# Altium schematic sheet MaxModule.SchDoc
size A4; SheetNumber: 5; SheetTotal: 6
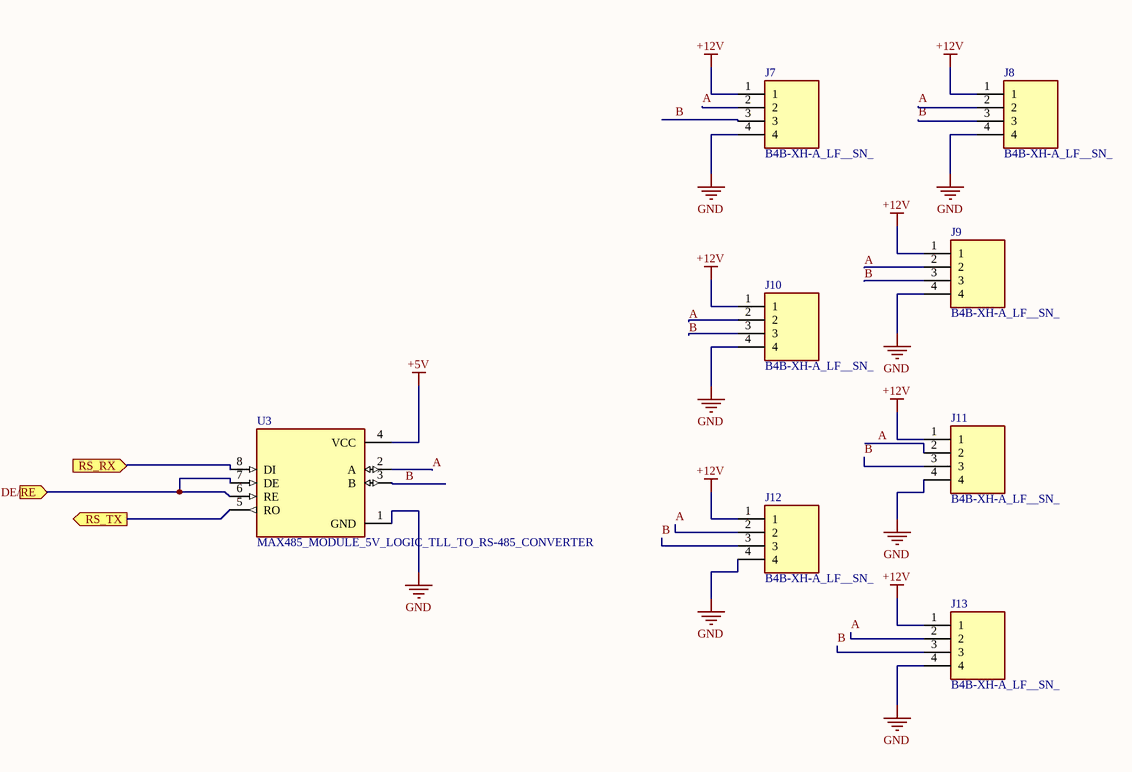
[diagram p0: MaxModule.SchDoc]

## Parts
J7  B4B-XH-A_LF__SN_  [B4BXHALFSN]
J8  B4B-XH-A_LF__SN_  [B4BXHALFSN]
J9  B4B-XH-A_LF__SN_  [B4BXHALFSN]
J10  B4B-XH-A_LF__SN_  [B4BXHALFSN]
J11  B4B-XH-A_LF__SN_  [B4BXHALFSN]
J12  B4B-XH-A_LF__SN_  [B4BXHALFSN]
J13  B4B-XH-A_LF__SN_  [B4BXHALFSN]
U3  MAX485_MODULE_5V_LOGIC_TLL_TO_RS-485_CONVERTER  [MODULE_MAX485_MODULE_5V_LOGIC_TLL_TO_RS-485_CONVERTER]

## Ports
DE/RE (in), RS_RX (in), RS_TX (out)

## Nets
+5V: U3.4(VCC)
+12V: J7.1 J8.1 J9.1 J10.1 J11.1 J12.1 J13.1
GND: J7.4 J8.4 J9.4 J10.4 J11.4 J12.4 J13.4 U3.1(GND)
A: J7.2 J8.2 J9.2 J10.2 J11.2 J12.2 J13.2 U3.2(A)
B: J7.3 J8.3 J9.3 J10.3 J11.3 J12.3 J13.3 U3.3(B)
DE/RE: U3.6(RE) U3.7(DE) ; port DE/RE
RS_RX: U3.8(DI) ; port RS_RX
RS_TX: U3.5(RO) ; port RS_TX

## Library data of the parts
J7-J13 = B4B-XH-A_LF__SN_: Connector; Manufacturer_Name: JST (JAPAN SOLDERLESS TERMINALS); Manufacturer_Part_Number: B4B-XH-A(LF)(SN); Datasheet Link: https://datasheet.lcsc.com/szlcsc/JST-Sales-America-B4B-XH-A-LF-SN_C144395.pdf; Height: 7mm; Mouser Part Number: 306-B4BXHALFSN; Mouser Price/Stock: https://www.mouser.co.uk/ProductDetail/JST-Commercial/B4B-XH-ALFSN?qs=cdbOS8ANM9CfC08d%252BywhFw%3D%3D; Arrow Part Number: B4B-XH-A(LF)(SN); Arrow Price/Stock: https://www.arrow.com/en/products/b4b-xh-a-lf-sn/jst-manufacturing?utm_currency=USD&region=europe
U3 = MAX485_MODULE_5V_LOGIC_TLL_TO_RS-485_CONVERTER: 5V MAX485 TTL To RS485 Converter Module Board for Arduino; MP: MAX485 Module 5V logic TLL to RS-485 converter; MF: e-Gizmo Mechatronix Central; Value: *; SnapEDA_Link: https://www.snapeda.com/parts/MAX485%20Module%205V%20logic%20TLL%20to%20RS-485%20converter/e-Gizmo+Mechatronix+Central/view-part/?ref=snap; Package: Package; Availability: Not in stock; Check_prices: https://www.snapeda.com/parts/MAX485%20Module%205V%20logic%20TLL%20to%20RS-485%20converter/e-Gizmo+Mechatronix+Central/view-part/?ref=eda; Price: None